# EAGLE design NESRGB_AV_MultiOut (EAGLE 9.6.2)
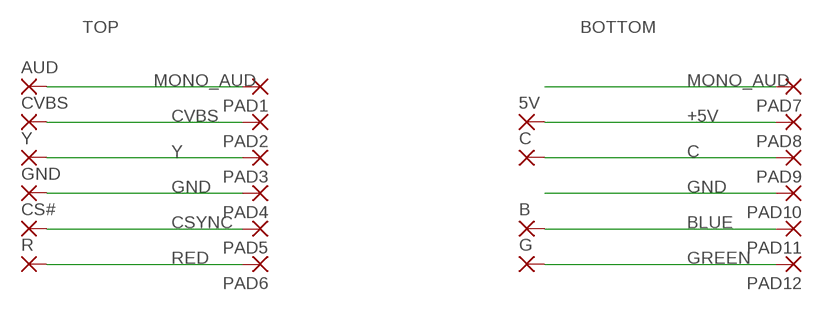
[diagram p0: schematic, sheet 1]

## Parts
5V  SMD2  [SMD1,27-2,54]
AUD  SMD2  [SMD1,27-2,54]
B  SMD2  [SMD1,27-2,54]
C  SMD2  [SMD1,27-2,54]
CS#  SMD2  [SMD1,27-2,54]
CVBS  SMD2  [SMD1,27-2,54]
G  SMD2  [SMD1,27-2,54]
GND  SMD2  [SMD1,27-2,54]
PAD1  SMD_PADNIN_AV  [SMD_NINAV]
PAD2  SMD_PADNIN_AV  [SMD_NINAV]
PAD3  SMD_PADNIN_AV  [SMD_NINAV]
PAD4  SMD_PADNIN_AV  [SMD_NINAV]
PAD5  SMD_PADNIN_AV  [SMD_NINAV]
PAD6  SMD_PADNIN_AV  [SMD_NINAV]
PAD7  SMD_PADNIN_AV  [SMD_NINAV]
PAD8  SMD_PADNIN_AV  [SMD_NINAV]
PAD9  SMD_PADNIN_AV  [SMD_NINAV]
PAD10  SMD_PADNIN_AV  [SMD_NINAV]
PAD11  SMD_PADNIN_AV  [SMD_NINAV]
PAD12  SMD_PADNIN_AV  [SMD_NINAV]
R  SMD2  [SMD1,27-2,54]
Y  SMD2  [SMD1,27-2,54]

## Nets
+5V: 5V.1(P) PAD8.1(P)
BLUE: B.1(P) PAD11.1(P)
C: C.1(P) PAD9.1(P)
CSYNC: CS#.1(P) PAD5.1(P)
CVBS: CVBS.1(P) PAD2.1(P)
GND: GND.1(P) PAD4.1(P) PAD10.1(P)
GREEN: G.1(P) PAD12.1(P)
MONO_AUD: AUD.1(P) PAD1.1(P) PAD7.1(P)
RED: PAD6.1(P) R.1(P)
Y: PAD3.1(P) Y.1(P)

## Notes on the sheet
- TOP | BOTTOM

## Library data of the parts
5V AUD B C CS# CVBS G GND R Y = wirepad:SMD2: SMD PAD
PAD1-PAD12 = My_Devices:SMD_PAD: SMD PAD

## Board
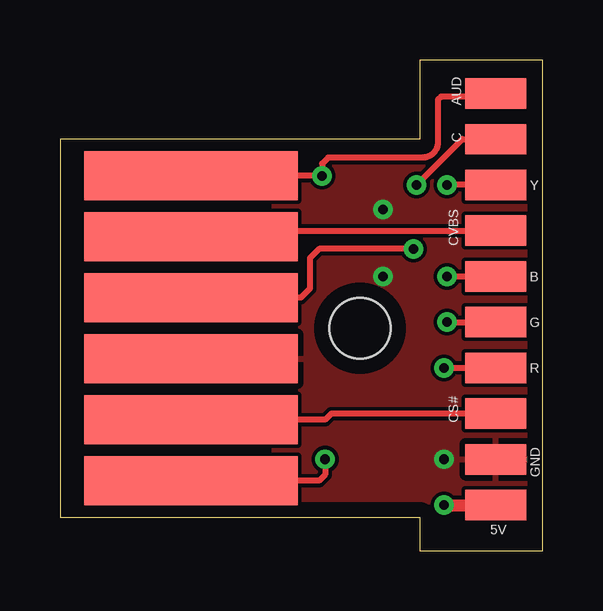
[diagram p1: board, top side]
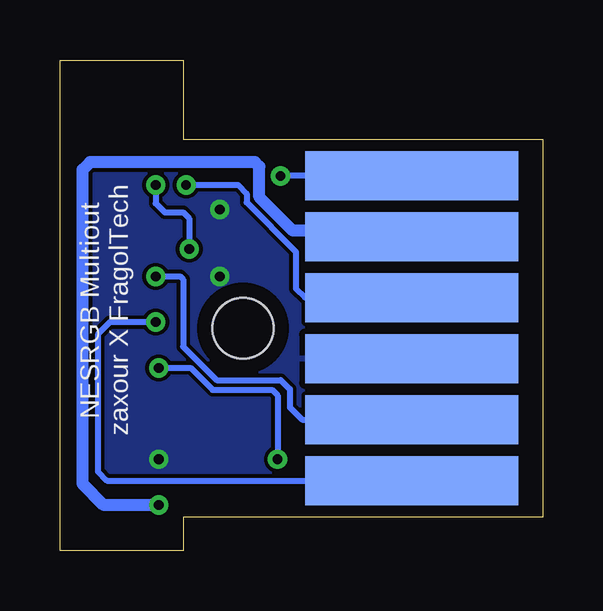
[diagram p2: board, bottom side, seen from below]

Size 20.12 x 20.45 mm. Coordinates in mm from the lower left corner, seen from the top.
Outline: 0,17.15 0,1.4 14.99,1.4 14.99,0 20.12,0 20.12,20.45 14.99,20.45 14.99,17.15 0,17.15
Copper layers (1*16): Top 0.035mm / dielectric 1.5mm / Bottom 0.035mm
Design rules "default *": minimum track width 6mil, minimum drill 0.35mm, track to track 6mil, track to pad 6mil, pad to pad 6mil, via to via 6mil, smd to smd 6mil, copper to edge 25mil, drill to drill 6mil, minimum pad ring 10mil, minimum via ring 8mil, stop-mask expansion 4mil, vias tented up to drill 16mil, thermal gap 10mil
Holes 2.54 mm at 12.5,9.27

### Footprints (pad centres in the part's own frame; a part is rotated, then mirrored left to right if it is on the bottom)
SMD1,27-2,54 = smd 1.27 x 2.54: 1 0,0
SMD_NINAV = smd 2.032 x 8.89: 1 0,0

### Placement (x,y rotation side)
5V  18.16,1.91 270 top
AUD  18.16,19.05 270 top
B  18.16,11.43 270 top
C  18.16,17.15 270 top
CS#  18.16,5.71 270 top
CVBS  18.16,13.33 270 top
G  18.16,9.53 270 top
GND  18.16,3.81 270 top
PAD1  5.46,15.62 270 top
PAD2  5.46,13.08 270 top
PAD3  5.46,10.54 270 top
PAD4  5.46,8 270 top
PAD5  5.46,5.46 270 top
PAD6  5.46,2.92 270 top
PAD7  5.46,15.62 90 bottom
PAD8  5.46,13.08 90 bottom
PAD9  5.46,10.54 90 bottom
PAD10  5.46,8 90 bottom
PAD11  5.46,5.46 90 bottom
PAD12  5.46,2.92 90 bottom
R  18.16,7.62 270 top
Y  18.16,15.24 270 top

### Tracks (layer width: path | path; a pad name or v marks a point on that pad's centre or on a via)
+5V  (via drill 0.4)
  Top 0.508: v16,1.91 5V.1
  Bottom 0.508: v16,1.91 18.29,1.91 19.18,2.79 19.18,15.88 18.86,16.19 12,16.19 11.81,16 11.81,14.73 10.41,13.33 5.71,13.33 PAD8.1
BLUE  (via drill 0.4)
  Top 0.254: v16.13,11.43 B.1
  Bottom 0.254: v16.13,11.43 15.11,11.43 14.99,11.3 14.99,8.51 13.59,7.11 10.92,7.11 10.54,6.73 10.54,5.97 10.03,5.46 PAD11.1
C  (via drill 0.4)
  Top 0.254: v14.86,15.24 16.76,17.15 C.1
  Bottom 0.254: v14.86,15.24 13.97,15.24 13.59,15.24 12.7,15.24 12.34,14.88 12.34,14.51 10.29,12.45 10.29,10.92 9.91,10.54 PAD9.1
CSYNC
  Top 0.254: PAD5.1 11.05,5.46 11.3,5.71 CS#.1
CVBS
  Top 0.254: PAD2.1 5.71,13.33 CVBS.1
GND  (via drill 0.4)
  other vias: 16,3.81 13.46,11.43 13.46,14.22
  pour Top: 22.86,22.23 8.89,22.23 8.89,-1.91 22.86,-1.91
  pour Bottom: 22.86,-1.91 8.89,-1.91 8.89,22.23 22.86,22.23
GREEN  (via drill 0.4)
  Top 0.254: v16.13,9.53 G.1
  Bottom 0.254: v16.13,9.53 18.03,9.53 18.54,9.02 18.54,3.3 18.16,2.92 PAD12.1
MONO_AUD  (via drill 0.4)
  Top 0.254: AUD.1 18.16,18.92 15.88,18.92 15.75,18.8 15.75,17.02 arc-90 15.11,16.38 11.18,16.38 10.92,16.13 v10.92,15.62 PAD7.1
  Bottom 0.254: PAD7.1 v10.92,15.62
RED  (via drill 0.4)
  Top 0.254: v16,7.62 R.1 | v11.05,3.81 11.05,3.17 10.79,2.92 PAD6.1
  Bottom 0.254: v16,7.62 14.67,7.62 13.76,6.71 11.28,6.71 11.05,6.48 v11.05,3.81
Y  (via drill 0.4)
  Top 0.254: Y.1 v16.13,15.24 | PAD3.1 10.03,10.54 10.41,10.92 10.41,12.19 10.79,12.57 v14.73,12.57
  Bottom 0.254: v16.13,15.24 16.13,14.48 15.75,14.1 14.99,14.1 14.73,13.84 v14.73,12.57

### Text on the board
bNames: NESRGB Multiout / zaxour X FragolTech
Reference: D(Audio) / A(DNU) / B(DNU) / GND(DNU) / C / Y / V(doodoo) / B / G / R / CS# / PPUV(DNU) / GND / 5V